# Altium schematic sheet Pl_clocksystem.SchDoc
size A4; SheetNumber: 3; SheetTotal: 3
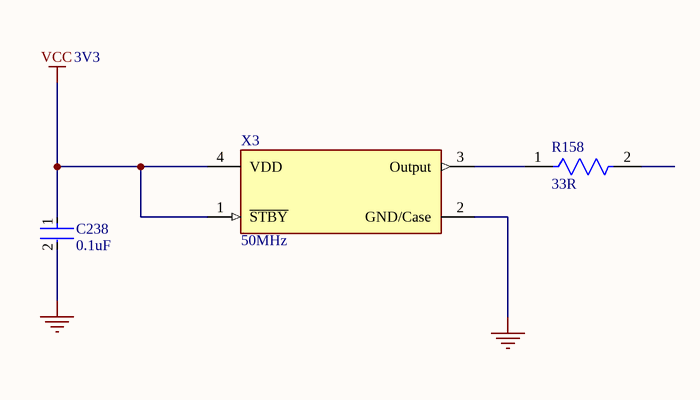
[diagram p0: Pl_clocksystem.SchDoc]

## Parts
C238  0.1uF  [FP-C0402-BB-MFG]
R158  33R  [FP-CRCW0603-e3-IPC_A]
X3  50MHz  [FP-ASE-MFG]

## Nets
NetC238_2: C238.2 X3.2(GND/Case)
VCC: C238.1 X3.1(~{STBY}) X3.4(VDD)
NetR158_1: R158.1 X3.3(Output)

Not connected (* = marked no-connect by the designer): R158 2

## Notes on the sheet
- 3V3

## Library data of the parts
C238 = CMP-2008-02046-2: CAP CER 0.1UF 10V X5R 0402; Manufacturer: Kemet; Manufacturer Part Number: C0402C104K8PACTU; Material: Ceramic; Capacitance: 0.10 μF; Temperature Coefficient: 15%; Description: C0402 0.10 μF X5R 10.00% 10 V; Tolerance: 0.1; Value: 0.10 μF; Package: C0402-BB; Temperature: -55°C to +125°C; ComponentLink2Description: Datasheet; Temperature Characteristic: X5R; Device Class L1: Passive Components; Height: 0.55mm; Lead Free: Yes; ComponentLink2URL: https://content.kemet.com/datasheets/KEM_C1002_X7R_SMD.pdf; Device Class L2: Capacitors; Temperature Range Low: -55°C; Temperature Range High: +125°C; RoHS: TRUE; Octopart: https://octopart.com/c0402c104k8pactu-kemet-140039; Automotive: No; Mouser Description: Capacitor 100 nF 10 VDC 0402; Category: Cap; Voltage Rating: 10 V; Digikey Description: CAP CER 0.1UF 10V X5R 0402; Ipc Land Pattern Name: CAPC10050X50; Device Class L3: Ceramic Capacitors
R158 = CMP-2000-03250-2: RES Thick Film, 33Ω, 1%, 0.1W, 100ppm/°C, 0603; Voltage Rating: 75V; Max Power Dissipation: 100mW; Case/Package: 0603; Weight: 7.1E-05oz; Termination: SMD/SMT; Voltage Rating (DC): 75V; Packaging: Tape and Reel; Width: 0.85mm; Depth: 0.85mm; Mount: Surface Mount; Number of Terminations: 2; Min Operating Temperature: -55°C; Military Standard: Not; Package Quantity: 10; Contact Plating: Tin; Resistance: 33R; Radiation Hardening: No; Lead Free: Lead Free; Tolerance: 1%; Power Rating: 100mW; Features: Automotive AEC-Q200; Height: 0.45mm; Case Code (Metric): 1608; Length: 1.55mm; Composition: Thick Film; Max Operating Temperature: 155°C; Temperature Coefficient: 100ppm/°C; Case Code (Imperial): 0603
X3 = CMP-27762-009764-1: XTAL Oscillator 50MHz ±50ppm CMOS 3.3V 4-SMD 3.2mm x 2.5mm; Load Capacitance: 15pF; Max Supply Current: 19mA; Min Supply Voltage: 3.135V; Max Supply Voltage: 3.465V; Packaging: Tape and Reel; Height: 0.047inch; Mount: Surface Mount; Frequency Stability: 50ppm; Lead Free: Lead Free; Number of Pins: 4; Width: 0.098inch; Radiation Hardening: No; Max Operating Temperature: 85°C; Length: 3.2mm; REACH SVHC: No SVHC; Series: ASE; Depth: 2.5mm; Operating Supply Voltage: 3.3V; Min Operating Temperature: -40°C; Package Quantity: 1000; Operating Frequency: 50 MHz; Case/Package: SMD/SMT; Termination: SMD/SMT; Frequency: 50MHz